# EAGLE design R-Split_level_Shifuter (EAGLE 7.2.0)
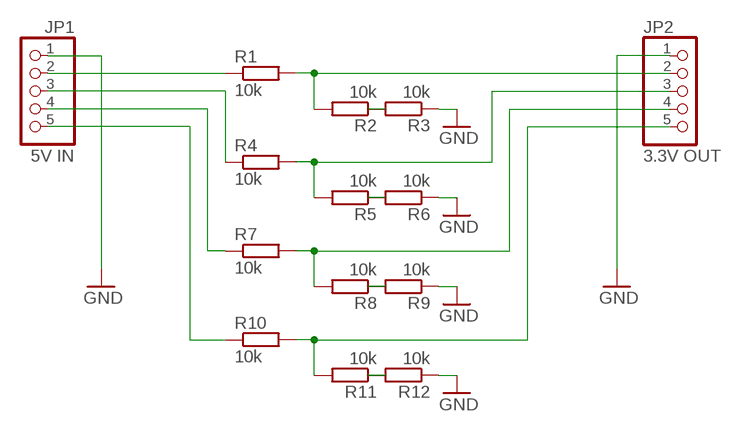
[diagram p0: schematic, sheet 1]

## Parts
JP1  5V IN  PINHD-1X5  [1X05]
JP2  3.3V OUT  PINHD-1X5  [1X05]
R1  10k  R-EU_0207/7  [0207/7]
R2  10k  R-EU_0207/7  [0207/7]
R3  10k  R-EU_0207/7  [0207/7]
R4  10k  R-EU_0207/7  [0207/7]
R5  10k  R-EU_0207/7  [0207/7]
R6  10k  R-EU_0207/7  [0207/7]
R7  10k  R-EU_0207/7  [0207/7]
R8  10k  R-EU_0207/7  [0207/7]
R9  10k  R-EU_0207/7  [0207/7]
R10  10k  R-EU_0207/7  [0207/7]
R11  10k  R-EU_0207/7  [0207/7]
R12  10k  R-EU_0207/7  [0207/7]

## Nets
GND: JP1.1 JP2.1 R3.1 R6.1 R9.1 R12.1
N$1: R2.1 R3.2
N$2: JP1.2 R1.1
N$3: JP2.2 R1.2 R2.2
N$4: JP2.4 R7.2 R8.2
N$5: JP2.3 R4.2 R5.2
N$6: R5.1 R6.2
N$7: R8.1 R9.2
N$8: JP2.5 R10.2 R11.2
N$9: R11.1 R12.2
N$10: JP1.3 R4.1
N$11: JP1.4 R7.1
N$14: JP1.5 R10.1

## Library data of the parts
JP1 JP2 = pinhead:PINHD-1X5: PIN HEADER
R1-R12 = rcl:R-EU_: RESISTOR, European symbol

## Board
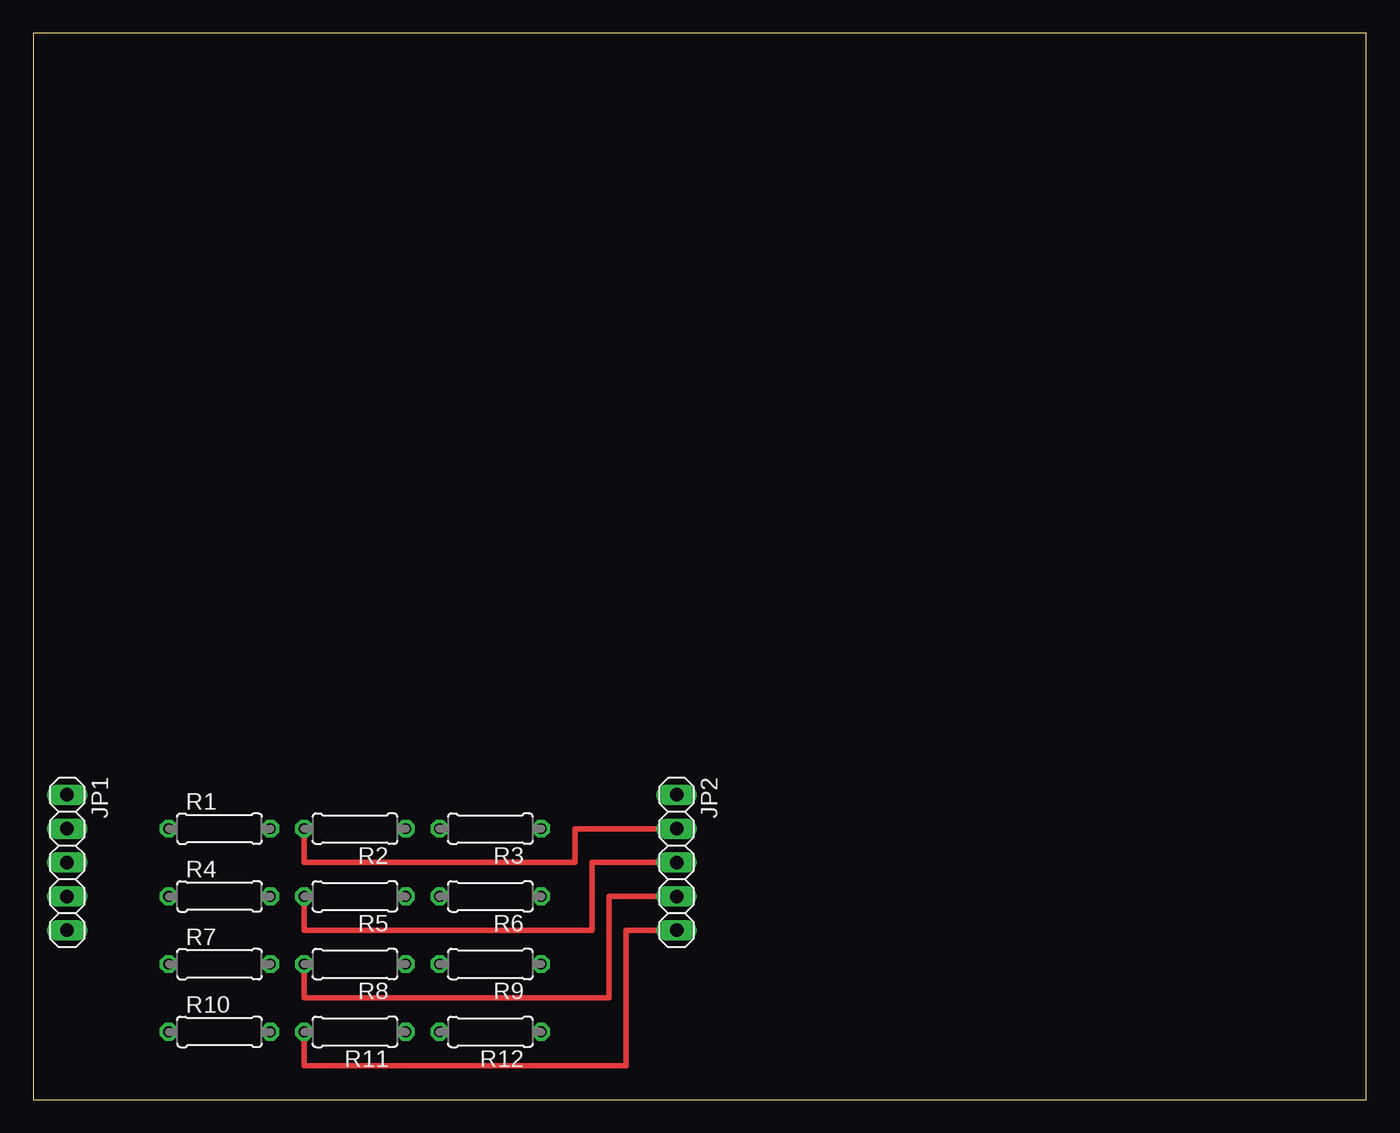
[diagram p1: board, top side]
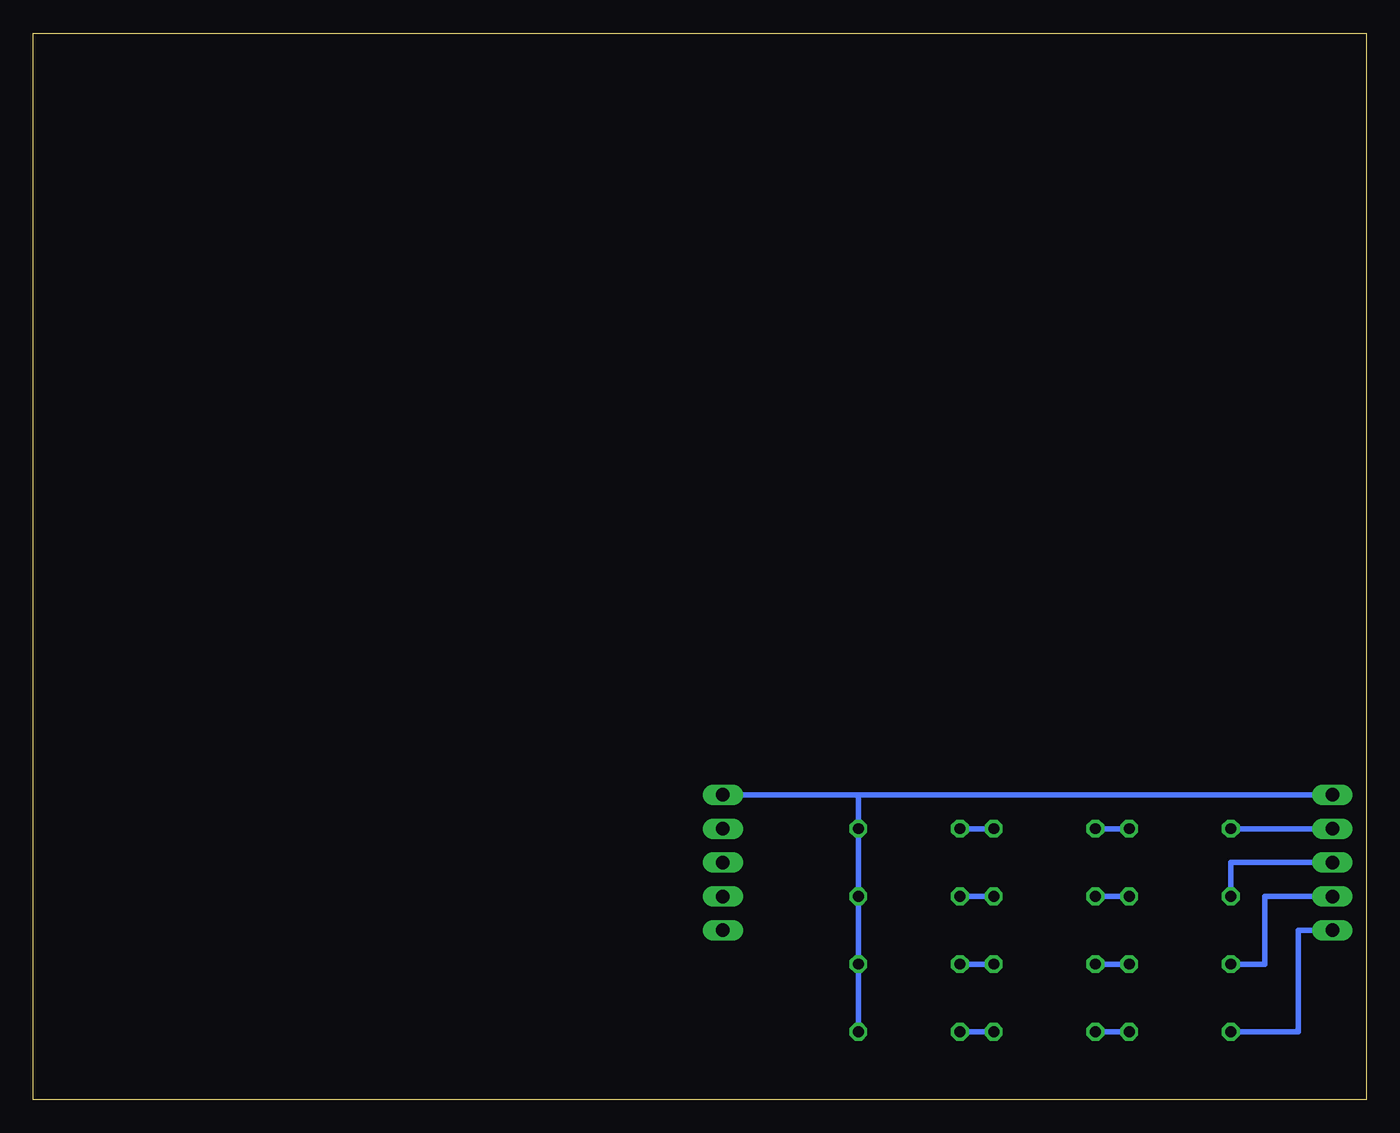
[diagram p2: board, bottom side, seen from below]

Size 100 x 80 mm. Coordinates in mm from the lower left corner, seen from the top.
Outline: 0,0 100,0 100,80 0,80 0,0
Copper layers (1*16): Top 0.035mm / dielectric 1.5mm / Bottom 0.035mm
Design rules "default": minimum track width 10mil, minimum drill 24mil, track to track 8mil, track to pad 8mil, pad to pad 8mil, via to via 8mil, smd to smd 8mil, copper to edge 40mil, drill to drill 8mil, minimum pad ring 10mil, minimum via ring 8mil, stop-mask expansion 4mil, vias tented up to drill 0mil, thermal gap 10mil

### Footprints (pad centres in the part's own frame; a part is rotated, then mirrored left to right if it is on the bottom)
1X05 = drill 1.016 long: 1 -5.08,0; 2 -2.54,0; 3 0,0; 4 2.54,0; 5 5.08,0
0207/7 = drill 0.813 octagon: 1 -3.81,0; 2 3.81,0

### Placement (x,y rotation side)
JP1  2.54,17.78 270 top
JP2  48.26,17.78 270 top
R1  13.97,20.32 0 top
R2  24.13,20.32 180 top
R3  34.29,20.32 180 top
R4  13.97,15.24 0 top
R5  24.13,15.24 180 top
R6  34.29,15.24 180 top
R7  13.97,10.16 0 top
R8  24.13,10.16 180 top
R9  34.29,10.16 180 top
R10  13.97,5.08 0 top
R11  24.13,5.08 180 top
R12  34.29,5.08 180 top

### Tracks (layer width: path | path; a pad name or v marks a point on that pad's centre or on a via)
GND
  Bottom 0.406: R12.1 R9.1 R6.1 R3.1 38.1,22.86 | JP1.1 38.1,22.86 | 38.1,22.86 JP2.1
N$1
  Bottom 0.406: R2.1 R3.2
N$2
  Bottom 0.406: JP1.2 R1.1
N$3
  Top 0.406: R2.2 20.32,17.78 40.64,17.78 40.64,20.32 JP2.2
  Bottom 0.406: R1.2 R2.2
N$4
  Top 0.406: R8.2 20.32,7.62 43.18,7.62 43.18,15.24 JP2.4
  Bottom 0.406: R7.2 R8.2
N$5
  Top 0.406: R5.2 20.32,12.7 41.91,12.7 41.91,17.78 JP2.3
  Bottom 0.406: R4.2 R5.2
N$6
  Bottom 0.406: R5.1 R6.2
N$7
  Bottom 0.406: R8.1 R9.2
N$8
  Top 0.406: R11.2 20.32,2.54 44.45,2.54 44.45,12.7 JP2.5
  Bottom 0.406: R10.2 R11.2
N$9
  Bottom 0.406: R11.1 R12.2
N$10
  Bottom 0.406: JP1.3 10.16,17.78 R4.1
N$11
  Bottom 0.406: JP1.4 7.62,15.24 7.62,10.16 R7.1
N$14
  Bottom 0.406: JP1.5 5.08,12.7 5.08,5.08 R10.1